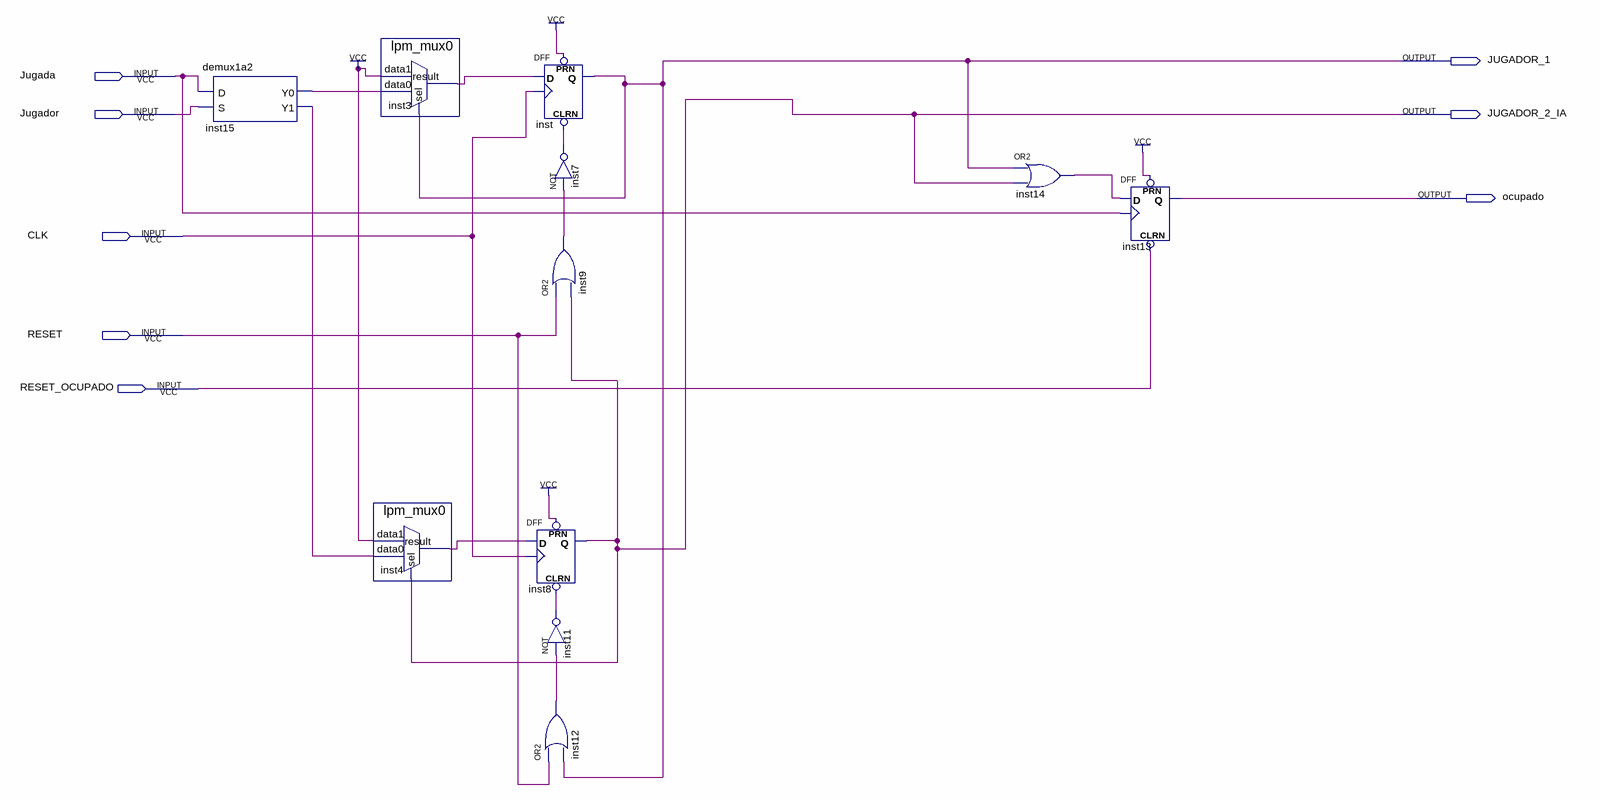
[diagram p0: schematic sheet]
// Quartus schematic Almace2.bdf as structural Verilog: 11 symbols, 8 pins
module Almace2 (
  input  Jugada,
  input  Jugador,
  input  CLK,
  input  RESET,
  input  RESET_OCUPADO,
  output JUGADOR_1,
  output JUGADOR_2_IA,
  output ocupado
);

  wire inst3_result, inst4_result, inst7_out, inst9_out, inst11_out, inst12_out, inst14_out, inst15_y0,
       inst15_y1;

  demux1a2 inst15 (.D(Jugada), .S(Jugador), .Y0(inst15_y0), .Y1(inst15_y1));
  lpm_mux0 inst3 (.data1(1'b1), .data0(inst15_y0), .sel(JUGADOR_1), .result(inst3_result));
  lpm_mux0 inst4 (.data1(1'b1), .data0(inst15_y1), .sel(JUGADOR_2_IA), .result(inst4_result));
  DFF inst8 (.CLRN(inst11_out), .CLK(CLK), .D(inst4_result), .PRN(1'b1), .Q(JUGADOR_2_IA));
  DFF inst (.CLRN(inst7_out), .CLK(CLK), .D(inst3_result), .PRN(1'b1), .Q(JUGADOR_1));
  not inst7 (inst7_out, inst9_out);
  or inst9 (inst9_out, RESET, JUGADOR_2_IA);
  not inst11 (inst11_out, inst12_out);
  or inst12 (inst12_out, RESET, JUGADOR_1);
  or inst14 (inst14_out, JUGADOR_1, JUGADOR_2_IA);
  DFF inst13 (.CLRN(RESET_OCUPADO), .CLK(Jugada), .D(inst14_out), .PRN(1'b1), .Q(ocupado));
endmodule
